# EAGLE design Schaltplan-LED (EAGLE 7.2.0)
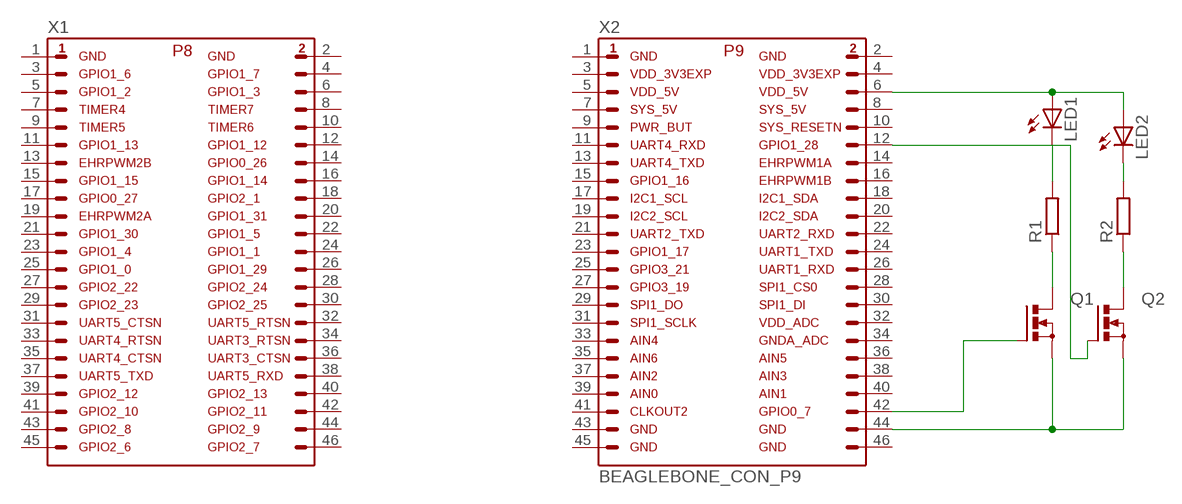
[diagram p0: schematic, sheet 1]

## Parts
LED1  LEDCHIP-LED0603  [CHIP-LED0603]
LED2  LEDCHIP-LED0603  [CHIP-LED0603]
Q1  N-MOSFET-SO8S  [SO-08]
Q2  N-MOSFET-SO8S  [SO-08]
R1  R-EU_R0603  [R0603]
R2  R-EU_R0603  [R0603]
X1  BEAGLEBONE_CON_P8  [23X2_2-54]
X2  BEAGLEBONE_CON_P9  [23X2_2-54]

## Nets
N$1: LED1.A LED2.A X2.6
N$2: LED1.C R1.2
N$3: Q1.4(G) X2.42
N$4: Q1.5(D) Q1.6(D) Q1.7(D) Q1.8(D) R1.1
N$5: Q1.1(S) Q1.2(S) Q1.3(S) Q2.1(S) Q2.2(S) Q2.3(S) X2.44
N$7: LED2.C R2.2
N$8: Q2.4(G) X2.12
N$9: Q2.5(D) Q2.6(D) Q2.7(D) Q2.8(D) R2.1
Unconnected: X1.1 X1.2 X1.3 X1.4 X1.5 X1.6 X1.7 X1.8 X1.9 X1.10 X1.11 X1.12 X1.13 X1.14 X1.15 X1.16 X1.17 X1.18 X1.19 X1.20 X1.21 X1.22 X1.23 X1.24 X1.25 X1.26 X1.27 X1.28 X1.29 X1.30 X1.31 X1.32 X1.33 X1.34 X1.35 X1.36 X1.37 X1.38 X1.39 X1.40 X1.41 X1.42 X1.43 X1.44 X1.45 X1.46 X2.1 X2.2 X2.3 X2.4 X2.5 X2.7 X2.8 X2.9 X2.10 X2.11 X2.13 X2.14 X2.15 X2.16 X2.17 X2.18 X2.19 X2.20 X2.21 X2.22 X2.23 X2.24 X2.25 X2.26 X2.27 X2.28 X2.29 X2.30 X2.31 X2.32 X2.33 X2.34 X2.35 X2.36 X2.37 X2.38 X2.39 X2.40 X2.41 X2.43 X2.45 X2.46

## Library data of the parts
LED1 LED2 = led:LED: LED OSRAM: - CHIPLED LG R971, LG N971, LY N971, LG Q971, LY Q971, LO R971, LY R971 LH N974, LH R974 LS Q976, LO Q976, LY Q976 LO Q996 - Hyper CHIPLED LW Q18S LB Q993, LB Q99A, LB R99A - SideLED LS A670, LO A670, LY A670, LG A670, LP A670 LB A673, LV A673, LT A673, LW A673 LH A674 LY A675 LS A676, LA A676, LO A676, LY A676, LW A676 LS A679, LY A679, LG A679 - Hyper Micro SIDELED® LS Y876, LA Y876, LO Y876, LY Y876 LT Y87S - SmartLED LW L88C, LW L88S LB L89C, LB L89S, LG L890 LS L89K, LO L89K, LY L89K LS L896, LA L896, LO L896, LY L896 - TOPLED LS T670, LO T670, LY T670, LG T670, LP T670 LSG T670, LSP T670, LSY T670, LOP T670, LYG T670 LG T671, LOG T671, LSG T671 LB T673, LV T673, LT T673, LW T673 LH T674 LS T676, LA T676, LO T676, LY T676, LB T676, LH T676, LSB T676, LW T676 LB T67C, LV T67C, LT T67C, LS T67K, LO T67K, LY T67K, LW E67C LS E67B, LA E67B, LO E67B, LY E67B, LB E67C, LV E67C, LT E67C LW T67C LS T679, LY T679, LG T679 LS T770, LO T770, LY T770, LG T770, LP T770 LB T773, LV T773, LT T773, LW T773 LH T774 LS E675, LA E675, LY E675, LS T675 LS T776, LA T776, LO T776, LY T776, LB T776 LHGB T686 LT T68C, LB T68C - Hyper Mini TOPLED® LB M676 - Mini TOPLED Santana® LG M470 LS M47K, LO M47K, LY M47K Source: http://www.osram.convergy.de LUXEON: - LUMILED® LXK2-PW12-R00, LXK2-PW12-S00, LXK2-PW14-U00, LXK2-PW14-V00 LXK2-PM12-R00, LXK2-PM12-S00, LXK2-PM14-U00 LXK2-PE12-Q00, LXK2-PE12-R00, LXK2-PE12-S00, LXK2-PE14-T00, LXK2-PE14-U00 LXK2-PB12-K00, LXK2-PB12-L00, LXK2-PB12-M00, LXK2-PB14-N00, LXK2-PB14-P00, LXK2-PB14-Q00 LXK2-PR12-L00, LXK2-PR12-M00, LXK2-PR14-Q00, LXK2-PR14-R00 LXK2-PD12-Q00, LXK2-PD12-R00, LXK2-PD12-S00 LXK2-PH12-R00, LXK2-PH12-S00 LXK2-PL12-P00, LXK2-PL12-Q00, LXK2-PL12-R00 Source: www.luxeon.com KINGBRIGHT: KA-3528ASYC Source: www.kingbright.com
Q1 Q2 = transistor-power:N-MOSFET-SO8: N-Channel MOSFET Example: FDS7760A; N-Channel Logic Level PowerTrench® MOSFET FDS2572; N-Channel UltraFET® Trench MOSFET Source: www.fairchildsemi.com
R1 R2 = rcl:R-EU_: RESISTOR, European symbol
X1 = BeagleBone:BEAGLEBONE_CON_P8: BeagleBone Connector P8 by Rainer Lietz License: CC-Zero The SMD-Version has to be mirrored to the bottom layer of the PCB.
X2 = BeagleBone:BEAGLEBONE_CON_P9: BeagleBone Connector P9 by Rainer Lietz License: CC-Zero The SMD-Version has to be mirrored to the bottom layer of the PCB.

## Board
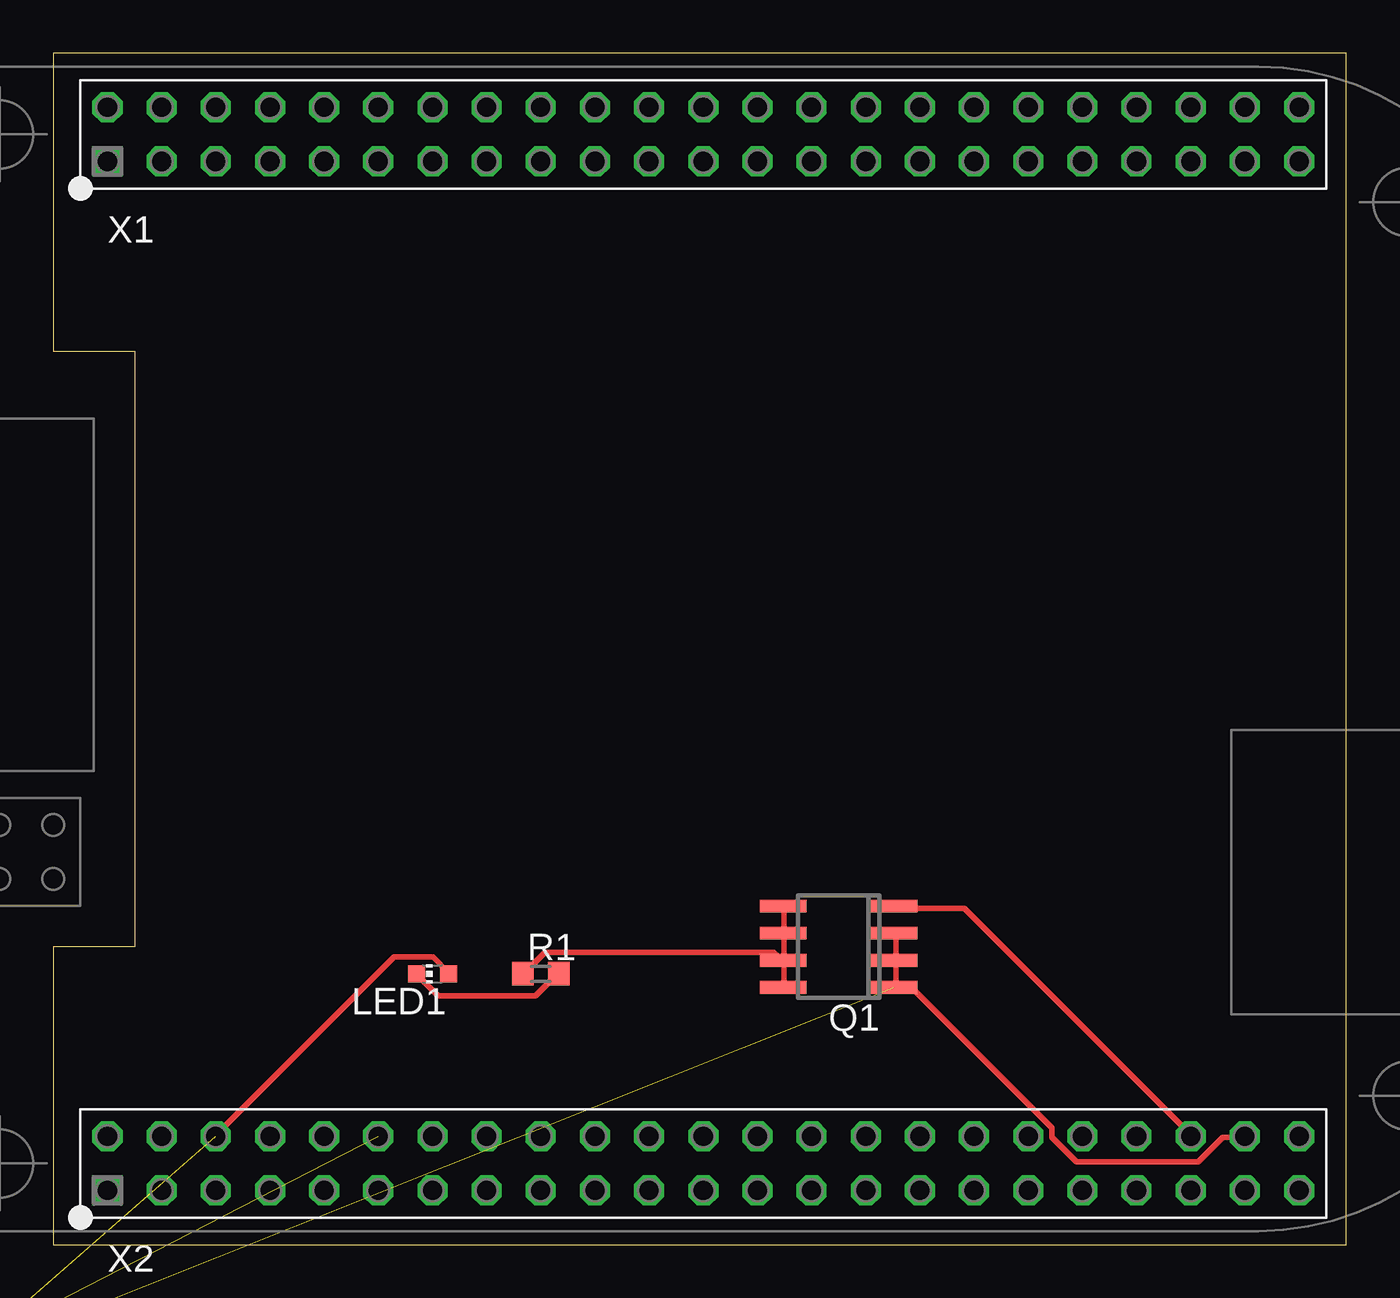
[diagram p1: board, top side]

Size 60.63 x 55.87 mm. Coordinates in mm from the lower left corner, seen from the top.
Outline: 0,0 60.63,0 60.63,55.87 0,55.87 0,41.91 3.81,41.91 3.81,13.97 0,13.97 0,0
Copper layers (1*16): Top 0.035mm / dielectric 1.5mm / Bottom 0.035mm
Design rules "default": minimum track width 10mil, minimum drill 24mil, track to track 8mil, track to pad 8mil, pad to pad 8mil, via to via 8mil, smd to smd 8mil, copper to edge 40mil, drill to drill 8mil, minimum pad ring 10mil, minimum via ring 8mil, stop-mask expansion 4mil, vias tented up to drill 0mil, thermal gap 10mil

### Footprints (pad centres in the part's own frame; a part is rotated, then mirrored left to right if it is on the bottom)
CHIP-LED0603 = smd 0.8 x 0.8: A 0,-0.75; C 0,0.75
SO-08 = smd 0.6 x 2.2: 1 -1.905,-2.6; 2 -0.635,-2.6; 3 0.635,-2.6; 4 1.905,-2.6; 5 1.905,2.6; 6 0.635,2.6; 7 -0.635,2.6; 8 -1.905,2.6
R0603 = smd 1 x 1.1: 1 -0.85,0; 2 0.85,0
23X2_2-54 = drill 0.9 square: 1 0,0 | drill 0.9 octagon: 2 0,2.54; 3 2.54,0; 4 2.54,2.54; 5 5.08,0; 6 5.08,2.54; 7 7.62,0; 8 7.62,2.54; 9 10.16,0; 10 10.16,2.54; 11 12.7,0; 12 12.7,2.54; 13 15.24,0; 14 15.24,2.54; 15 17.78,0; 16 17.78,2.54; 17 20.32,0; 18 20.32,2.54; 19 22.86,0; 20 22.86,2.54; 21 25.4,0; 22 25.4,2.54; 23 27.94,0; 24 27.94,2.54; 25 30.48,0; 26 30.48,2.54; 27 33.02,0; 28 33.02,2.54; 29 35.56,0; 30 35.56,2.54; 31 38.1,0; 32 38.1,2.54; 33 40.64,0; 34 40.64,2.54; 35 43.18,0; 36 43.18,2.54; 37 45.72,0; 38 45.72,2.54; 39 48.26,0; 40 48.26,2.54; 41 50.8,0; 42 50.8,2.54; 43 53.34,0; 44 53.34,2.54; 45 55.88,0; 46 55.88,2.54

### Placement (x,y rotation side)
LED1  17.78,12.7 90 top
LED2  -16.51,-15.24 0 top  (outside the outline)
Q1  36.83,13.97 90 top
Q2  -13.97,-6.35 0 top  (outside the outline)
R1  22.86,12.7 0 top
R2  -13.97,-12.7 0 top  (outside the outline)
U$1  [BEAGLEBONE-OUTLINE]  -17.78,0 0 top  (outside the outline)
X1  2.54,50.8 0 top
X2  2.54,2.54 0 top

### Tracks (layer width: path | path; a pad name or v marks a point on that pad's centre or on a via)
N$1  (1 unrouted)
  Top 0.254: LED1.A 18.49,12.8 17.8,13.49 15.98,13.49 7.75,5.26 X2.6
N$2
  Top 0.254: LED1.C 17.12,12.57 18.03,11.66 22.61,11.66 23.52,12.57 R1.2
N$3
  Top 0.254: Q1.4 39.52,15.77 42.72,15.77 53.24,5.26 X2.42
N$4
  Top 0.254: R1.1 22.15,12.8 23.06,13.72 33.81,13.72 34.04,13.49 Q1.7 | Q1.8 34.27,12.12 34.27,13.26 Q1.7 | Q1.7 34.27,13.49 34.27,14.4 Q1.6 34.27,14.63 34.27,15.77 Q1.5
N$5  (3 unrouted)
  Top 0.254: Q1.3 39.52,14.4 39.52,13.49 Q1.2 39.52,13.26 39.52,12.12 Q1.1 39.52,11.89 40.44,11.89 46.84,5.49 46.84,5.03 47.98,3.89 53.7,3.89 54.84,5.03 55.75,5.03 X2.44
N$7  (1 unrouted)
N$8  (1 unrouted)
N$9  (4 unrouted)